# EasyEDA schematic GuitArduino Schematic EasyEDA.json
TITLE: GuitArduino Schematic; REV: 1.0; Date: 2020-03-20; Sheet: 1/1; Drawn By: tcrichards4; Company: Thomas Corp
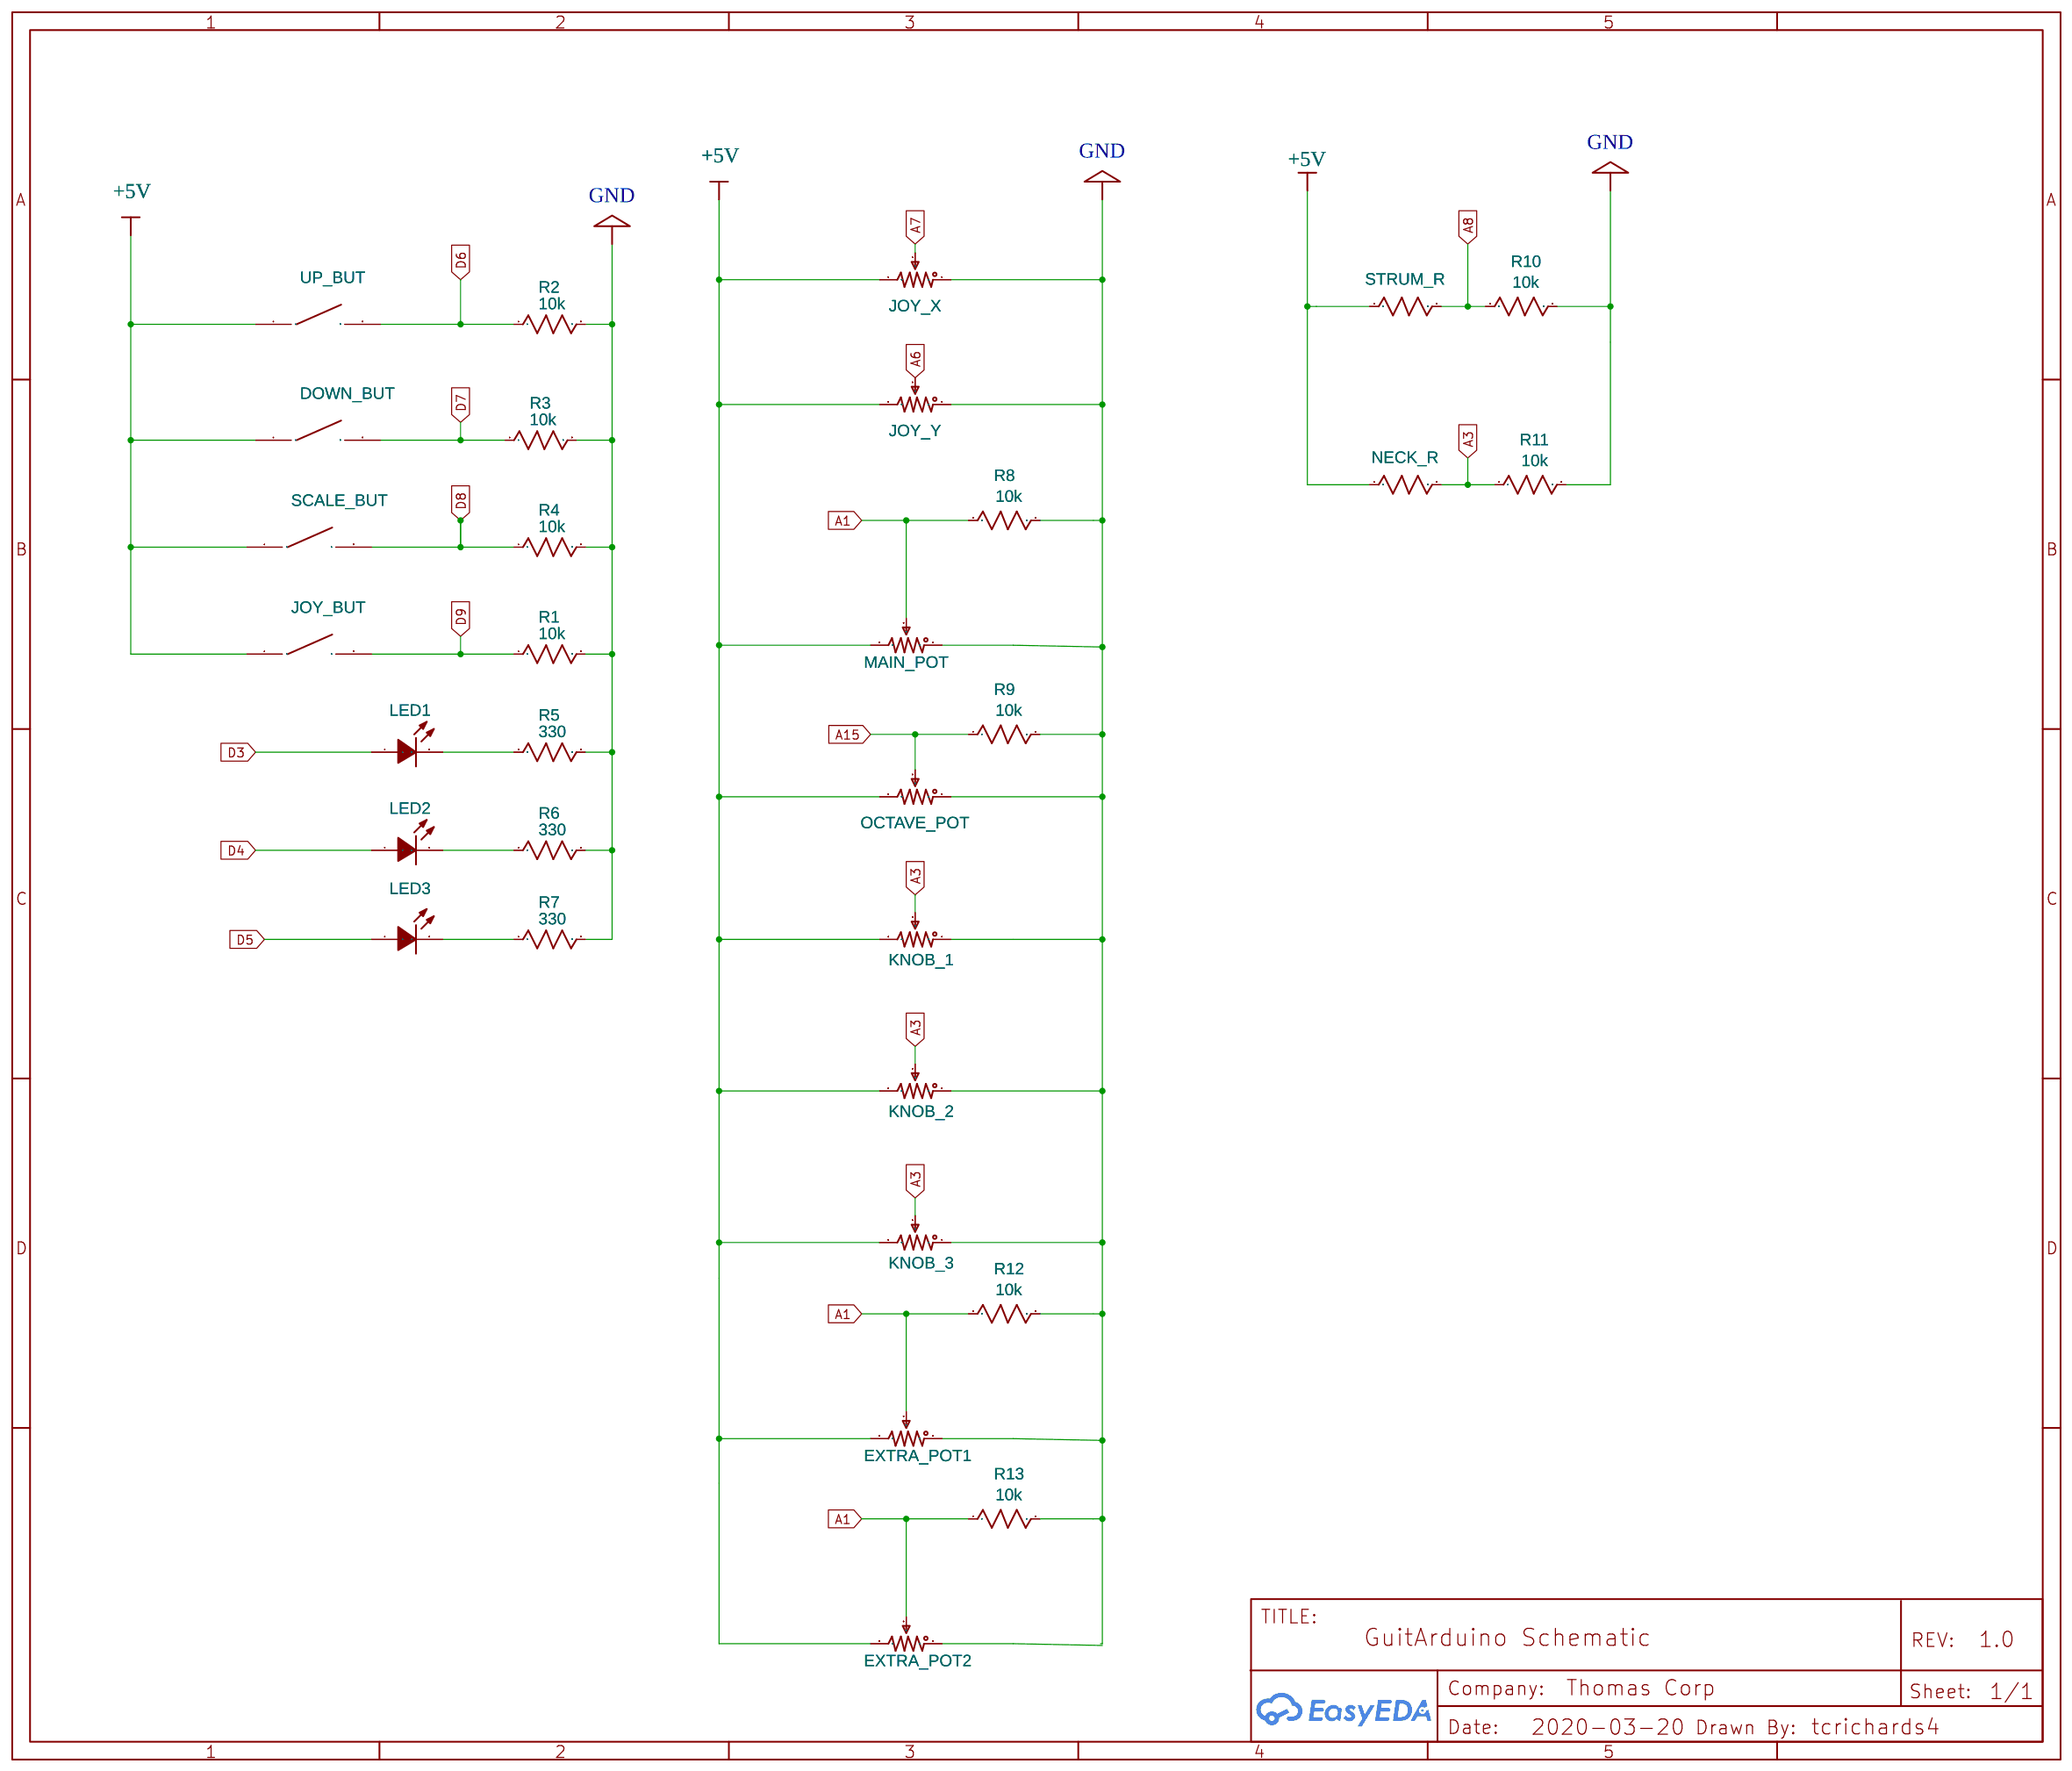
[diagram p0: schematic sheet]

## Parts
DOWN_BUT  EVQ22705R  [KEY-6.0*6.0-4]
EXTRA_POT1  100  [RES-ADJ_3386P]
EXTRA_POT2  100  [RES-ADJ_3386P]
JOY_BUT  EVQ22705R  [KEY-6.0*6.0-4]
JOY_X  100  [RES-ADJ_3386P]
JOY_Y  100  [RES-ADJ_3386P]
KNOB_1  100  [RES-ADJ_3386P]
KNOB_2  100  [RES-ADJ_3386P]
KNOB_3  100  [RES-ADJ_3386P]
LED1  204-10SURD/S530-A3  [LED-3MM/2.54]
LED2  204-10SURD/S530-A3  [LED-3MM/2.54]
LED3  204-10SURD/S530-A3  [LED-3MM/2.54]
MAIN_POT  100  [RES-ADJ_3386P]
NECK_R  1k  [AXIAL-0.3]
OCTAVE_POT  100  [RES-ADJ_3386P]
R1  10k  [AXIAL-0.3]
R2  10k  [AXIAL-0.3]
R3  10k  [AXIAL-0.3]
R4  10k  [AXIAL-0.3]
R5  330  [AXIAL-0.3]
R6  330  [AXIAL-0.3]
R7  330  [AXIAL-0.3]
R8  10k  [AXIAL-0.3]
R9  10k  [AXIAL-0.3]
R10  10k  [AXIAL-0.3]
R11  10k  [AXIAL-0.3]
R12  10k  [AXIAL-0.3]
R13  10k  [AXIAL-0.3]
SCALE_BUT  EVQ22705R  [KEY-6.0*6.0-4]
STRUM_R  1k  [AXIAL-0.3]
UP_BUT  EVQ22705R  [KEY-6.0*6.0-4]

## Library data of the parts
DOWN_BUT JOY_BUT SCALE_BUT UP_BUT = EVQ22705R: Supplier: LCSC; Manufacturer: PANASONIC; Contributor: LCSC; Supplier Part: C79156
EXTRA_POT1 EXTRA_POT2 JOY_X JOY_Y KNOB_1-KNOB_3 MAIN_POT OCTAVE_POT = 3386P-1-101LF_US: Supplier: LCSC; Manufacturer: Bochen; Manufacturer Part: 3386P-1-101LF; Contributor: EasyEDA; Supplier Part: C125022
LED1-LED3 = 204-10SURD/S530-A3: Supplier: LCSC; Manufacturer: EVERLIGHT; Supplier Part: C99772
NECK_R R1-R13 STRUM_R = Res_AXIAL-0.3(1/8W)_US

## Nets
+5V: DOWN_BUT.1 EXTRA_POT1.3 EXTRA_POT2.3 JOY_BUT.1 JOY_X.3 JOY_Y.3 KNOB_1.3 KNOB_2.3 KNOB_3.3 MAIN_POT.3 NECK_R.1 OCTAVE_POT.3 SCALE_BUT.1 STRUM_R.1 UP_BUT.1
GND: EXTRA_POT1.1 JOY_X.1 JOY_Y.1 KNOB_1.1 KNOB_2.1 KNOB_3.1 MAIN_POT.1 OCTAVE_POT.1 R1.2 R2.2 R3.2 R4.2 R5.2 R6.2 R7.2 R8.2 R9.2 R10.2 R11.2 R12.2 R13.2
A1: EXTRA_POT1.2 EXTRA_POT2.2 MAIN_POT.2 R8.1 R12.1 R13.1
A3: KNOB_1.2 KNOB_2.2 KNOB_3.2 NECK_R.2 R11.1
A6: JOY_Y.2
A7: JOY_X.2
A8: R10.1 STRUM_R.2
A15: OCTAVE_POT.2 R9.1
D3: LED1.1(A)
D4: LED2.1(A)
D5: LED3.1(A)
D6: R2.1 UP_BUT.2
D7: DOWN_BUT.2 R3.1
D8: R4.1 SCALE_BUT.2
D9: JOY_BUT.2 R1.1
Net-(LED1-2): LED1.2(K) R5.1
Net-(LED2-2): LED2.2(K) R6.1
Net-(LED3-2): LED3.2(K) R7.1

Not connected (* = marked no-connect by the designer): EXTRA_POT2 1
